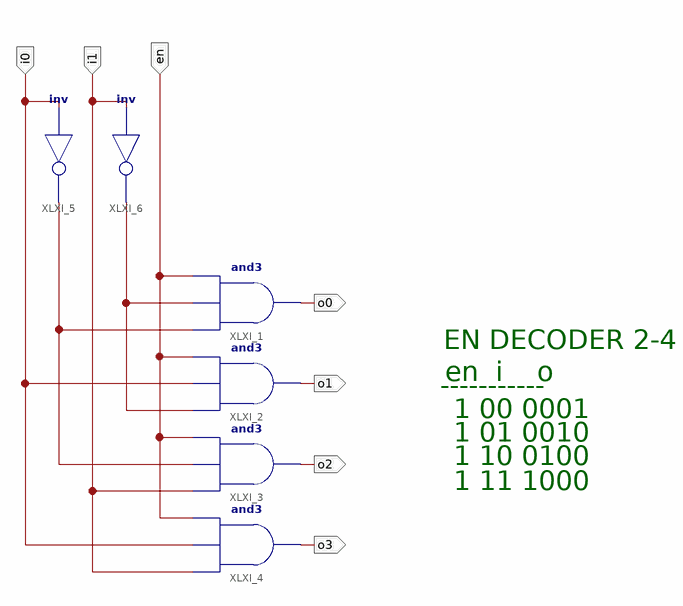
[diagram p0: schematic sheet 1]
// Xilinx ISE schematic sch_e_2_9_2_1.sch (spartan3e) as structural Verilog: 6 symbols, 7 ports
module sch_e_2_9_2_1 (
  input  i0,
  input  i1,
  input  en,
  output o0,
  output o1,
  output o2,
  output o3
);

  wire XLXN_5, XLXN_6;

  not XLXI_5 (XLXN_6, i0);
  not XLXI_6 (XLXN_5, i1);
  and XLXI_1 (o0, XLXN_6, XLXN_5, en);
  and XLXI_2 (o1, XLXN_5, i0, en);
  and XLXI_3 (o2, i1, XLXN_6, en);
  and XLXI_4 (o3, i1, i0, en);

  // Notes on the sheet:
  //   EN DECODER 2-4
  //   en  i    o
  //   -----------
  //   1 00 0001
  //   1 01 0010
  //   1 10 0100
  //   1 11 1000
endmodule
